# EAGLE design (Eagle)USB_JST-XH_Converter (EAGLE 9.6.2)

## Sheet 1 of 3
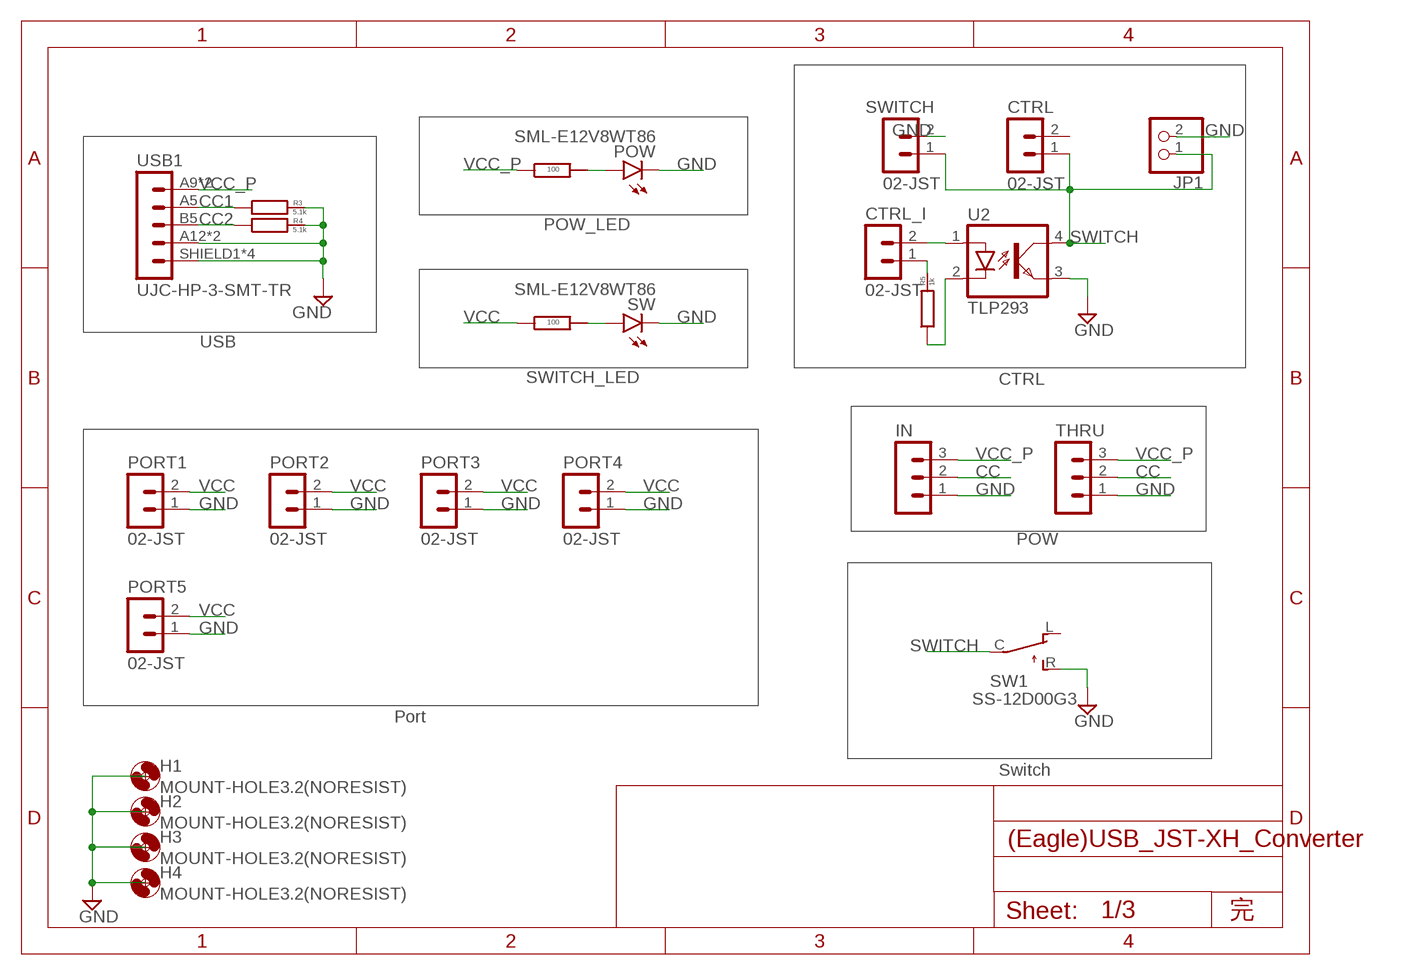
[diagram p0: schematic, sheet 1]

### Parts
CTRL  02-JST  [B2B-XH]
CTRL_I  02-JST  [B2B-XH]
H1  MOUNT-HOLE3.2(NORESIST)  [3,2]
H2  MOUNT-HOLE3.2(NORESIST)  [3,2]
H3  MOUNT-HOLE3.2(NORESIST)  [3,2]
H4  MOUNT-HOLE3.2(NORESIST)  [3,2]
IN  03-JST  [B3B-XH]
JP1  PINHD-1X2  [1X02]
PORT1  02-JST  [B2B-XH]
PORT2  02-JST  [B2B-XH]
PORT3  02-JST  [B2B-XH]
PORT4  02-JST  [B2B-XH]
PORT5  02-JST  [B2B-XH]
POW  SML-E12V8WT86  [SML-E12V8WT86]
R1  RG2012N-101-B-T5  [RG2012]
R2  RG2012N-101-B-T5  [RG2012]
R3  5.1k  RG2012  [RG2012]
R4  5.1k  RG2012  [RG2012]
R5  1k  RG2012  [RG2012]
SW  SML-E12V8WT86  [SML-E12V8WT86]
SW1  SS-12D00G3  [SS-12D00G3]
SWITCH  02-JST  [B2B-XH]
THRU  03-JST  [B3B-XH]
U2  TLP293  [SO4_TOS]
USB1  UJC-HP-3-SMT-TR  [UJC-HP-3-SMT-TR]

### Nets
CC: IN.2 THRU.2 ; also sheet 3
CC1: R3.LEFT USB1.A5(CC1) ; also sheet 3
CC2: R4.LEFT USB1.B5(CC2) ; also sheet 3
GND: H1.P$1 H2.P$1 H3.P$1 H4.P$1 IN.1 JP1.2 PORT1.1 PORT2.1 PORT3.1 PORT4.1 PORT5.1 POW.K(C) R3.RIGHT R4.RIGHT SW1.R SW.K(C) SWITCH.2 THRU.1 U2.3 USB1.A12(GND) USB1.B12(GND) USB1.SHIELD1(SHIELD) USB1.SHIELD2(SHIELD) USB1.SHIELD3(SHIELD) USB1.SHIELD4(SHIELD) ; also sheet 2,3
N$1: POW.A R1.LEFT
N$3: R2.LEFT SW.A
N$8: CTRL_I.2 U2.1
N$9: CTRL_I.1 R5.RIGHT
N$10: R5.LEFT U2.2
SWITCH: CTRL.1 JP1.1 SW1.C SWITCH.1 U2.4 ; also sheet 2
VCC: PORT1.2 PORT2.2 PORT3.2 PORT4.2 PORT5.2 R2.RIGHT ; also sheet 2
VCC_P: IN.3 R1.RIGHT THRU.3 USB1.A9(V-BUS) USB1.B9(V-BUS) ; also sheet 2,3
Unconnected: CTRL.2 SW1.L

### Notes on the sheet
- POW_LED
- USB
- SWITCH_LED | CTRL
- POW
- Port
- Switch
- 完

## Sheet 2 of 3
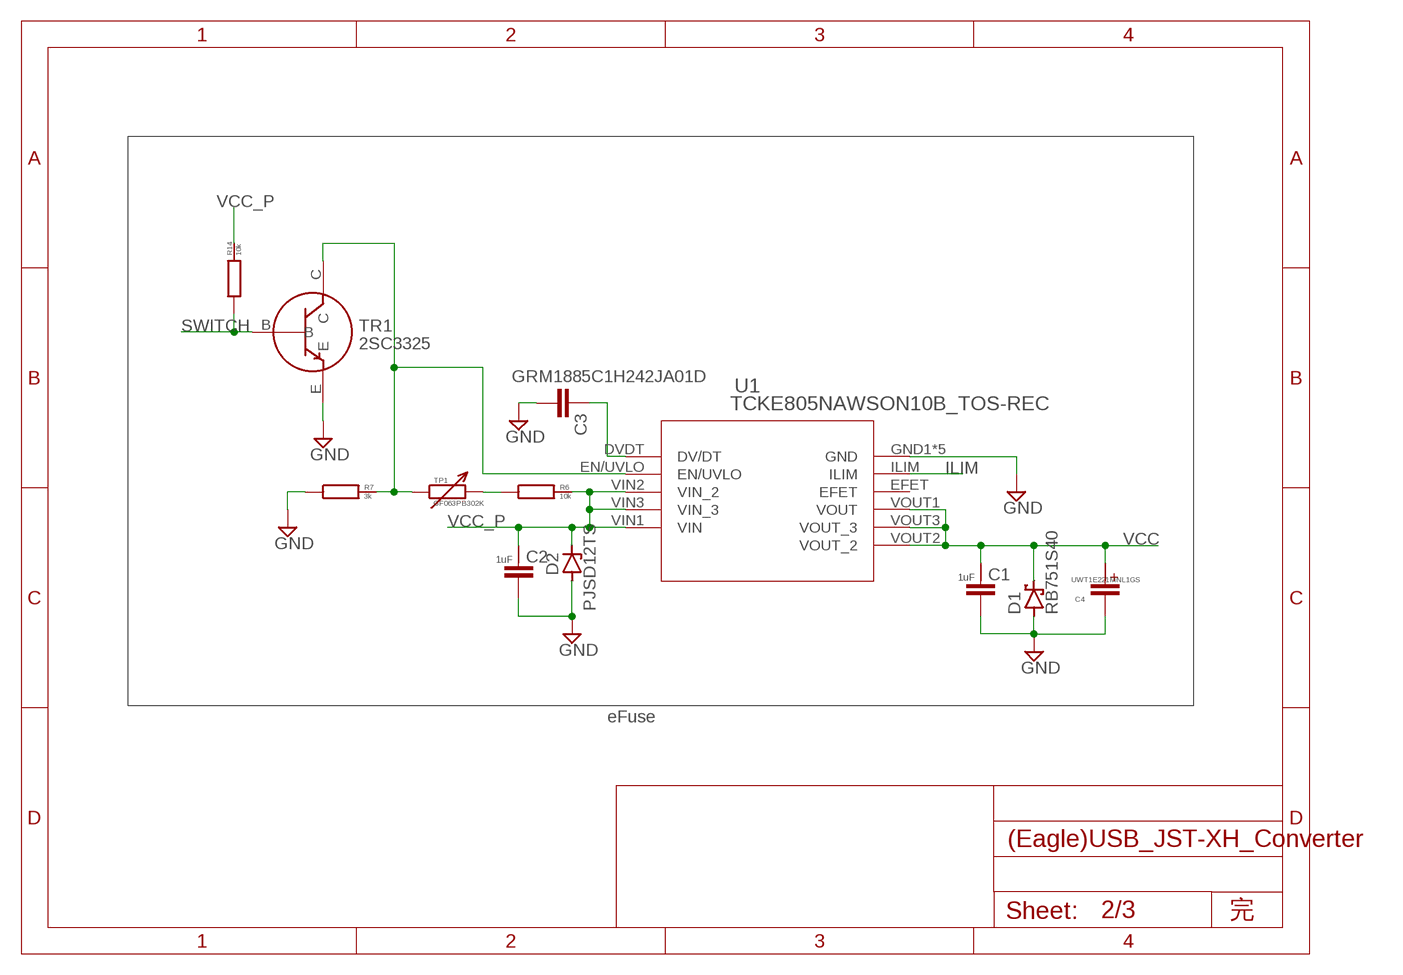
[diagram p1: schematic, sheet 2]

### Parts
C1  GRM21BC72A105KE01  [GRM21BC72A105KE01]
C2  GRM21BC72A105KE01  [GRM21BC72A105KE01]
C3  GRM1885C1H242JA01D  [GRM18]
C4  UWT1E221MNL1GS  [UWT1E221MNL1GS]
D1  RB751S40  [SOD-523]
D2  PJSD12TS  [SOD-523]
R6  10k  RG2012  [RG2012]
R7  3k  RG2012  [RG2012]
R14  10k  RG2012  [RG2012]
TP1  GF063PB302K  [GF063PB104K]
TR1  2SC3325  [2SC3325]
U1  TCKE805NAWSON10B_TOS-REC  [WSON10B_TOS-RIC]

### Nets
GND: C1.P$2 C2.P$2 C3.R C4.C(CATHODE) D1.A D2.A R7.LEFT TR1.E U1.GND1(GND) U1.GND2(GND) U1.GND3(GND) U1.GND4(GND) U1.GND5(GND) ; also sheet 1,3
ILIM: U1.ILIM ; also sheet 3
N$2: R7.RIGHT TP1.LEFT TR1.C U1.EN/UVLO
N$6: R6.LEFT TP1.CENTER(RIGHT) TP1.RIGHT
N$7: C3.L U1.DVDT(DV/DT)
SWITCH: R14.LEFT TR1.B ; also sheet 1
VCC: C1.P$1 C4.A(ANODE) D1.C U1.VOUT1(VOUT) U1.VOUT2(VOUT_2) U1.VOUT3(VOUT_3) ; also sheet 1
VCC_P: C2.P$1 D2.C R6.RIGHT R14.RIGHT U1.VIN1(VIN) U1.VIN2(VIN_2) U1.VIN3(VIN_3) ; also sheet 1,3
Unconnected: U1.EFET

### Notes on the sheet
- eFuse
- 完

## Sheet 3 of 3
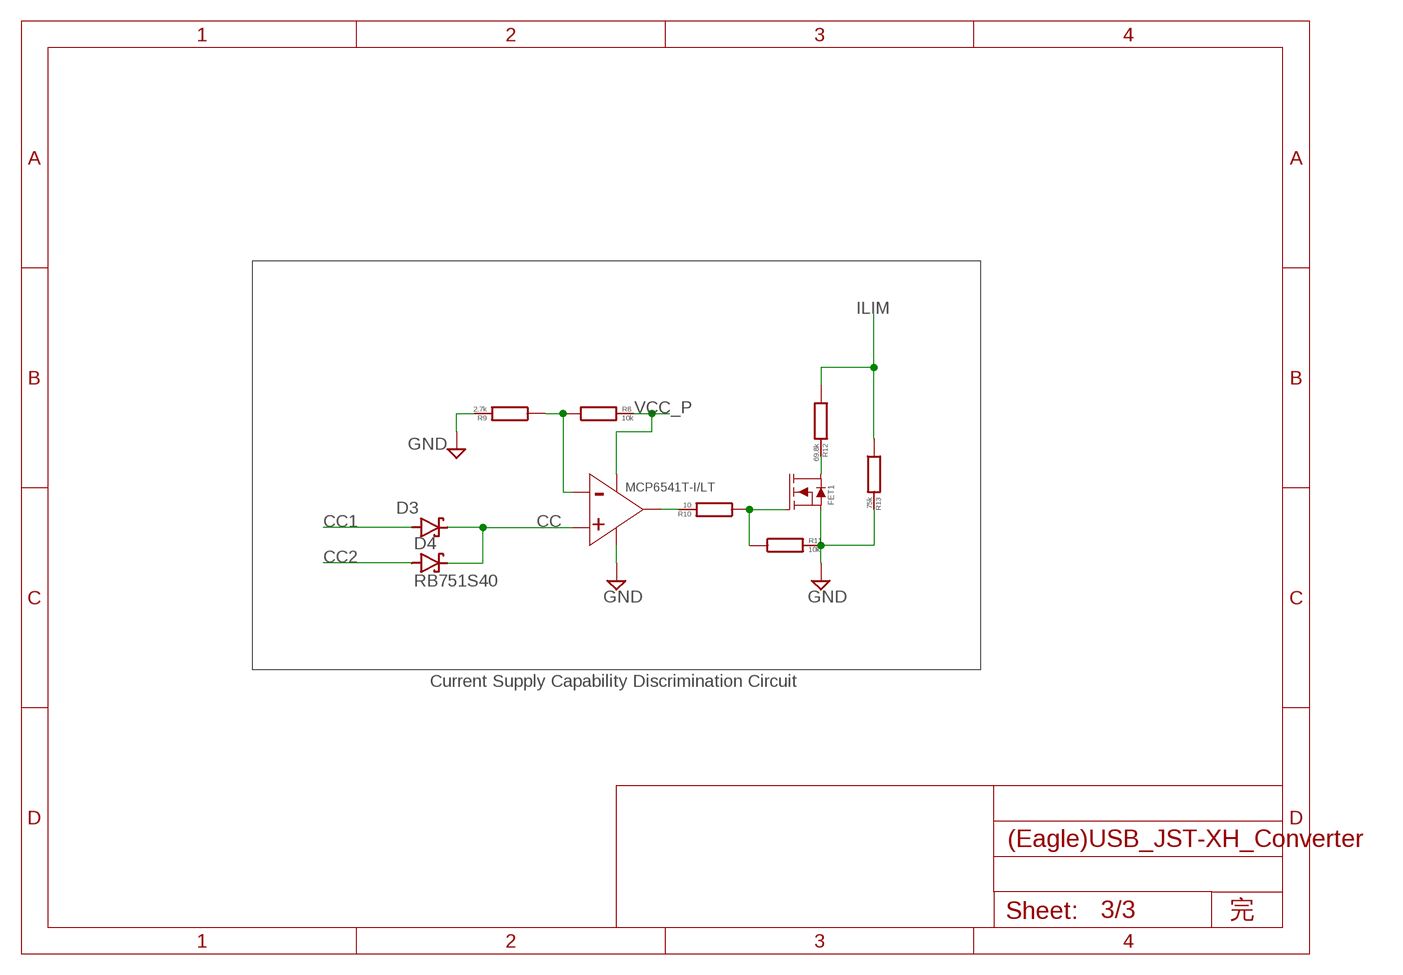
[diagram p2: schematic, sheet 3]

### Parts
COMP1  MCP6541T-I/LT  [SC-70-5]
D3  RB751S40  [SOD-523]
D4  RB751S40  [SOD-523]
FET1  BSS138  [SOT-23]
R8  10k  RG2012  [RG2012]
R9  2.7k  RG2012  [RG2012]
R10  10  RG2012  [RG2012]
R11  10k  RG2012  [RG2012]
R12  69.8k  RG2012  [RG2012]
R13  75k  RG2012  [RG2012]

### Nets
CC: COMP1.IN+ D3.C D4.C ; also sheet 1
CC1: D3.A ; also sheet 1
CC2: D4.A ; also sheet 1
GND: COMP1.VSS FET1.S R9.RIGHT R11.RIGHT R13.RIGHT ; also sheet 1,2
ILIM: R12.LEFT R13.LEFT ; also sheet 2
N$4: COMP1.IN- R8.LEFT R9.LEFT
N$5: FET1.G R10.LEFT R11.LEFT
N$12: COMP1.OUT R10.RIGHT
N$15: FET1.D R12.RIGHT
VCC_P: COMP1.VDD R8.RIGHT ; also sheet 1,2

### Notes on the sheet
- Current Supply Capability Discrimination Circuit
- 完

## Library data of the parts
C1 C2 = GRM21BC72A105KE01(1uF):GRM21BC72A105KE01
C3 = GRM1885C1H242JA01D:GRM1885C1H242JA01D
C4 = UWT1E221MNL1GS:UWT1E221MNL1GS
COMP1 = MCP6541T-I:MCP6541T-I/LT
CTRL CTRL_I PORT1-PORT5 SWITCH = con-jst-xh:02-JST: JST CONNECTOR
D1 D3 D4 = RB751S40:RB751S40
D2 = PJSD12TS:PJSD12TS
FET1 = BSS138:BSS138
H1-H4 = MOUNT-HOLE3.2(NORESIST):MOUNT-HOLE3.2(NORESIST)
IN THRU = con-jst-xh:03-JST: JST CONNECTOR
JP1 = pinhead:PINHD-1X2: PIN HEADER
POW SW = SML-E12V8WT86:SML-E12V8WT86
R1 R2 = RG2012N-101-B-T5:RG2012N-101-B-T5
R3-R14 = RG2012:RG2012
SW1 = SS-12D00G3:SS-12D00G3
TP1 = GF063P B104K:GF063PB302K
TR1 = 2SC3325:2SC3325
U1 = TCKE805NA:TCKE805NA
U2 = TLP293:TLP293; COPYRIGHT: Copyright (C) 2022 Ultra Librarian. All rights reserved.; MANUFACTURER_PART_NUMBER: TLP293; MFR_NAME: Toshiba Electronic Devices & Storage Corp.
USB1 = UJC-HP-3-SMT-TRv2:UJC-HP-3-SMT-TR

## Board
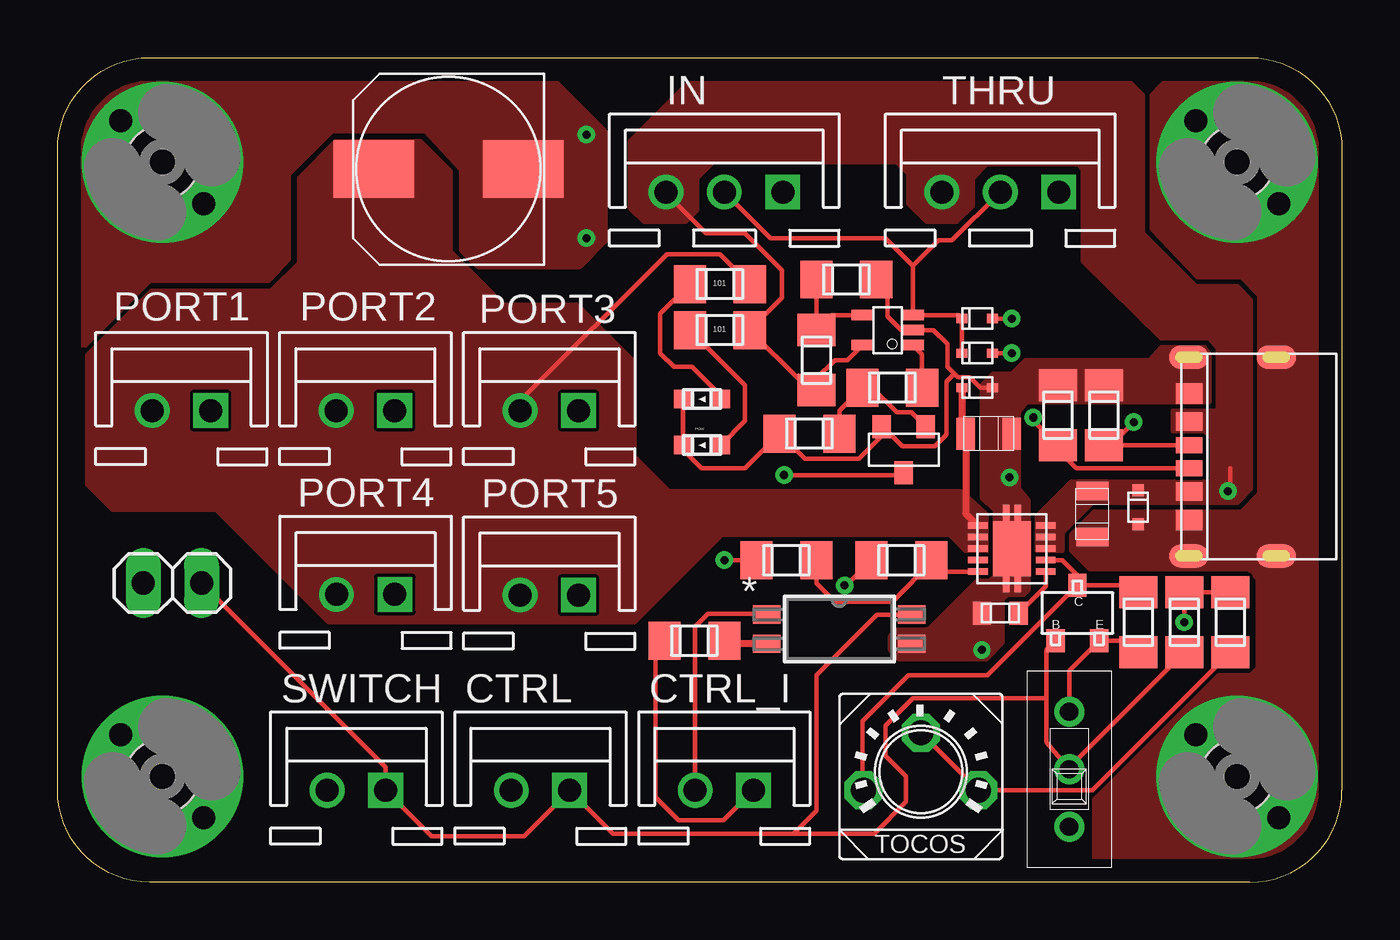
[diagram p3: board, top side]
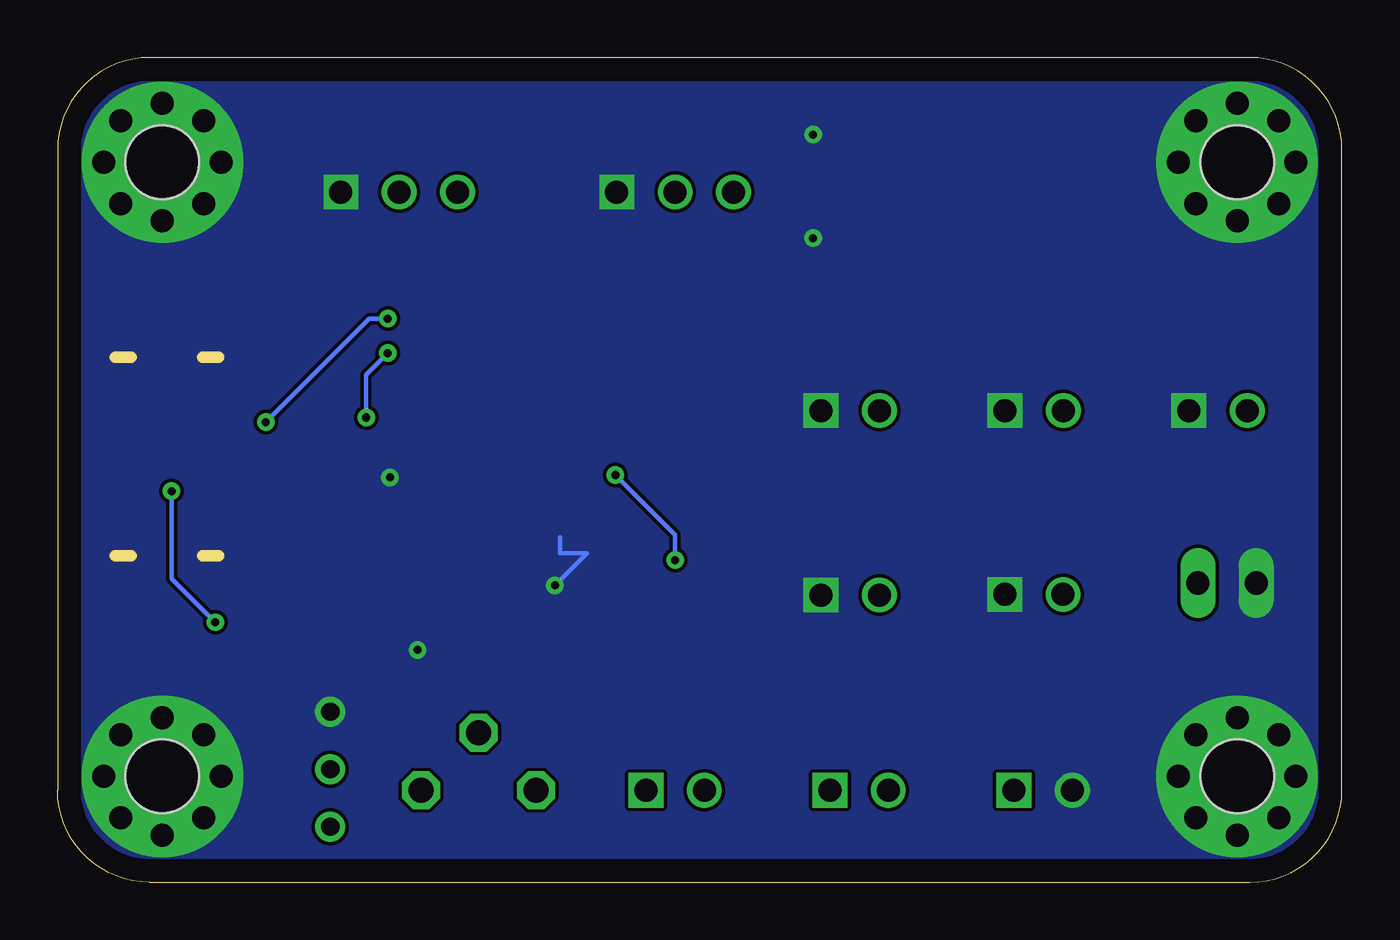
[diagram p4: board, bottom side, seen from below]

Size 55.86 x 35.85 mm. Coordinates in mm from the lower left corner, seen from the top.
Outline: 4,35.85 51.86,35.85 arc-90 55.86,31.85 55.86,4 arc-90 51.86,0 4,0 arc-90 0,4 0,31.85 arc-90 4,35.85
Copper layers (1*16): Top 0.035mm / dielectric 1.5mm / Bottom 0.035mm
Design rules "default": minimum track width 6mil, minimum drill 0.35mm, track to track 6mil, track to pad 6mil, pad to pad 6mil, via to via 6mil, smd to smd 6mil, copper to edge 40mil, drill to drill 6mil, minimum pad ring 10mil, minimum via ring 8mil, stop-mask expansion 4mil, vias tented up to drill 0mil, thermal gap 10mil

### Footprints (pad centres in the part's own frame; a part is rotated, then mirrored left to right if it is on the bottom)
GRM21BC72A105KE01 = smd 0.8 x 1.4: P$1 -1,0; P$2 1,0
GRM18 = smd 0.8 x 1: L -0.8,0; R 0.8,0
UWT1E221MNL1GS = smd 3.5 x 2.5: A -3.25,0; C 3.25,0
SC-70-5 = smd 0.45 x 0.95: IN+ -0.65,2.2; IN- -0.65,0; OUT 0.65,2.2; VDD 0.65,0; VSS 0,2.2
B2B-XH = drill 1 square: 1 1.27,0 | drill 1: 2 -1.27,0
SOD-523 = smd 0.48 x 0.4: A 0.66,0; C -0.66,0
SOD-523' = smd 0.53 x 0.5: A 0.735,0; C -0.735,0
SOT-23 = smd 0.8 x 1: D 0,2; G -0.95,0; S 0.95,0
3,2 = drill 3.197 pad 7.01: P$1 0,0 | hole 3.2: 0,0
B3B-XH = drill 1 square: 1 2.54,0 | drill 1: 2 0,0; 3 -2.54,0
1X02 = drill 1.016 long: 1 -1.27,0; 2 1.27,0
SML-E12V8WT86 = smd 0.8 x 0.8: A 0,1.65; K 0,0
RG2012 = smd 1.4 x 1.65: LEFT 0,0; RIGHT 2.6,0
SS-12D00G3 = drill 0.8: C 0,0; L -2.5,0; R 2.5,0
GF063PB104K = drill 1.1 octagon: CENTER 3.55,5.5; LEFT 1.05,3; RIGHT 6.05,3
2SC3325 = smd 1 x 0.8: B 0,1.9; C 2.4,0.95; E 0,0
WSON10B_TOS-RIC = smd 0.85 x 0.28: DVDT -1.475,1; EFET 1.475,0.5; EN/UVLO -1.475,0.5; ILIM 1.475,1; VIN1 -1.475,0; VIN2 -1.475,-0.5; VIN3 -1.475,-1; VOUT1 1.475,0; VOUT2 1.475,-0.5; VOUT3 1.475,-1 | smd 1.65 x 2.4: GND1 0,0 | smd 0.28 x 0.7: GND2 -0.25,1.55; GND3 0.25,1.55; GND4 -0.25,-1.55; GND5 0.25,-1.55
SO4_TOS = smd 1.2 x 0.8: 1 -3.15,0.635; 2 -3.15,-0.635; 3 3.15,-0.635; 4 3.15,0.635
UJC-HP-3-SMT-TR = smd 0.7 x 1.15: A5 -0.5,3.8; B5 0.5,3.8 | smd 0.8 x 1.15: A9 1.52,3.8; B9 -1.52,3.8 | smd 0.9 x 1.15: A12 2.75,3.8; B12 -2.75,3.8 | smd 1 x 1.7: SHIELD1 -4.32,3.8; SHIELD2 4.32,3.8; SHIELD3 -4.32,0; SHIELD4 4.32,0

### Placement (x,y rotation side)
C1  40.5,19.5 0 top
C2  45,16 270 top
C3  41,11.7 180 top
C4  17,31 0 top
COMP1  35,24 270 top
CTRL  21,4 0 top
CTRL_I  29,4 0 top
D1  40,21.5 0 top
D2  PJSD12TS  [SOD-523']  47,16.3 270 top
D3  40,23 0 top
D4  40,24.5 0 top
FET1  36.8,19.8 180 top
H1  4.56,31.3 0 top
H2  4.56,4.6 0 top
H3  51.3,31.3 0 top
H4  51.3,4.6 0 top
IN  29,30 0 top
JP1  5,13 180 top
PORT1  5.39,20.5 0 top
PORT2  13.39,20.5 0 top
PORT3  21.39,20.5 0 top
PORT4  13.4,12.51 0 top
PORT5  21.39,12.48 0 top
POW  27.2,19 270 top
R1  27.5,24 0 top
R2  27.5,26 0 top
R3  43.5,19 90 top
R4  45.5,19 90 top
R5  29,10.5 180 top
R6  51,10 90 top
R7  47,10 90 top
R8  33,24 270 top
R9  33,26.2 0 top
R10  35,21.5 0 top
R11  34,19.5 180 top
R12  33,14 180 top
R13  38,14 180 top
R14  49,10 90 top
SW  27.2,21 270 top
SW1  44,4.91 90 top
SWITCH  13,4 0 top
THRU  41,30 0 top
TP1  34,1 0 top
TR1  45.3,10.5 90 top
U1  41.5,14.5 180 top
U2  34,11 0 top
USB1  53,18.5 90 top

### Tracks (layer width: path | path; a pad name or v marks a point on that pad's centre or on a via)
CC
  Top 0.2: D3.C D4.C 39.19,24.65 COMP1.IN+ 37.2,26.8 | IN.2 31,28 36,28 37.2,26.8 | 37.2,26.8 38.3,27.9 38.9,27.9 THRU.2
CC1  (via drill 0.35)
  Top 0.2: USB1.A5 44.3,18 43.5,18.8 R3.LEFT 42.43,20.07 v42.43,20.2 | 40.66,22.94 D3.A v41.5,23
  Bottom 0.2: v42.43,20.2 42.43,22.07 v41.5,23
CC2  (via drill 0.35)
  Top 0.2: USB1.B5 R4.LEFT 45.8,19 v46.8,20 | v41.5,24.5 D4.A
  Bottom 0.2: v46.8,20 42.3,24.5 v41.5,24.5
GND  (via drill 0.35, 1)
  Top 0.2: SW1.R 44,9.2 TR1.E 46.5,10.5 R7.LEFT | R9.RIGHT 36.1,25.7 36.1,24.6 36.7,24 COMP1.VSS 38.1,24 38.7,23.4 38.7,22.4 39,22.1 | SW.K POW.K 27.2,18.8 28,18 29.9,18 R11.RIGHT 32.5,18.4 34.85,18.4 35.85,19.4 FET1.S 35.89,19.8 36.74,18.95 38.16,18.95 38.65,19.45 38.65,21.75 39,22.1 | D1.A 40.14,21.5 39.69,21.95 39.15,21.95 39,22.1 | R13.RIGHT 34.3,12.9 v34.23,12.9
  Bottom 0.2: v34.23,12.9 32.83,14.3 34,14.3 34,15
  other vias: 48.75,31.3 49.5,29.5 51.3,28.75 53.1,29.5 53.85,31.3 53.1,33.1 51.3,33.85 49.5,33.1 2.01,31.3 2.76,29.5 4.56,28.75 6.36,29.5 7.11,31.3 6.36,33.1 4.56,33.85 2.76,33.1 2.01,4.6 2.76,2.8 4.56,2.05 6.36,2.8 7.11,4.6 6.36,6.4 4.56,7.15 2.76,6.4 48.75,4.6 49.5,2.8 51.3,2.05 53.1,2.8 53.85,4.6 53.1,6.4 51.3,7.15 49.5,6.4 41.4,17.6 40.2,10.1 23,32.5 23,28
  pour Bottom (no thermals): -7,41 -7,-4 66,-4 66,43 -5,43
  pour Top (no thermals): 50.1,20.86 42.15,20.86 41.8,20.43 41.8,17.11 42.23,16.6 42.23,12.7 42,12.5 41.3,12.5 41.1,12.3 41.1,10.4 40.4,9.7 36.6,9.7 36.2,10.1 36.2,10.7 36.5,11 37.9,11 40,13.1 40.54,13.1 40.76,13.3 40.76,16.2 40.2,16.7 40.2,21.6 40.7,22.1 41.5,22.1 42.1,22.7 47.5,22.7 48,23.25 49.9,23.25 50.1,23
  pour Top (no thermals): 44.1,14.4 44.1,15.1 45.1,16.1 51.5,16.1 52.26,16.9 52.26,25.5 51.5,26.3 49.6,26.3 47.6,28.4 47.6,34.2 50.04,36.8 56.9,36.8 56.9,2 53.8,-1.1 53.7,-1 45.1,-1 45.1,3.6 50.5,9 51.9,9 52.2,9.3 52.2,13.2 51.8,13.6 44.9,13.6
  pour Top (no thermals): 4,26.2 9.18,26.2 10,27.1 10,30.8 11.94,32.7 16,32.7 17.6,31 17.6,27.5 18.3,26.8 22.7,26.8 23.8,27.9 23.8,32.6 19.1,37.3 3.6,37.3 -1.2,32.5 -1.2,22.3 0.1,22.3
ILIM
  Top 0.2: U1.ILIM 38.5,13.5 38.05,13.95 | 38.05,13.95 R13.LEFT | R12.LEFT 33,13 33.8,12.2 36.3,12.2 38.05,13.95
N$1
  Top 0.2: R1.LEFT 29.9,21.6 29.9,20.05 POW.A
N$2
  Top 0.2: TR1.C 44.35,13.35 43.7,14 U1.EN/UVLO | TR1.C 46.7,12.9 R7.RIGHT | TP1.LEFT 35,4.05 35,7 37,9 40.44,9 TR1.C
N$3
  Top 0.2: R2.LEFT 26.2,24.7 26.2,23 26.8,22.4 27.6,22.4 28.85,21.15 SW.A
N$4
  Top 0.2: R9.LEFT R8.LEFT 33.65,24.65 COMP1.IN-
N$5
  Top 0.2: R11.LEFT 34,20.5 R10.LEFT 35.42,21.5 36.49,20.42 37.13,20.42 FET1.G
N$6
  Top 0.2: TP1.CENTER TP1.RIGHT 45,4 R6.LEFT
N$7
  Top 0.2: U1.DVDT 42.98,12.88 C3.L
N$8
  Top 0.2: CTRL_I.2 27.73,11.11 28.3,11.68 30.81,11.68 U2.1
N$9
  Top 0.2: CTRL_I.1 28.97,2.7 27,2.7 26,3.7 26,10.1 R5.RIGHT
N$10
  Top 0.3: U2.2 29.14,10.36 R5.LEFT
N$12
  Top 0.2: COMP1.OUT 37.6,22.95 R10.RIGHT
N$15  (via drill 0.35)
  Top 0.2: R12.RIGHT v29,14 | FET1.D 36.7,17.7 v31.6,17.7
  Bottom 0.2: v29,14 29,15.1 v31.6,17.7
SWITCH
  Top 0.2: R14.LEFT 44.09,5.09 SW1.C 43,6.09 43,8 | TR1.B 43,10.1 43,8 | JP1.1 14.27,5 SWITCH.1 16.27,2 20.3,2 22.27,3.97 CTRL.1 24.15,2.12 32,2.12 | 32,2.12 33,3.12 33,9 35.63,11.64 U2.4 | 32,2.12 35.52,2.12 36.9,3.5 36.9,4.6 36,5.5 36,6.8 37.2,8 43,8
VCC
  Top 0.2: R2.RIGHT 28.8,27.3 26.5,27.3 20.12,20.92 PORT3.2
  Top 0.3: D1.C 39.34,19.66 C1.P$1 39.5,16.02 U1.VOUT3
  pour Top (no thermals): 40.4,14.3 39.6,14.3 38.8,15.1 28.9,15.1 25.1,11.3 11.8,11.3 6.9,16.2 2.4,16.2 1.3,17.3 1.3,22.9 4.1,25.7 9.3,25.7 10.5,26.9 10.5,30.6 12.1,32.2 15.8,32.2 17.1,30.9 17.1,27.4 19.4,25.1 22.6,25.1 25.1,22.6 25.1,18.5 26.6,17 39.3,17 40.4,16
VCC_P  (via drill 0.35)
  Top 0.2: 34.65,23.35 COMP1.VDD 34.35,22.7 33.8,22.7 33,21.9 R8.RIGHT | 33.1,21.8 R8.RIGHT | R8.RIGHT 32.3,21.8 R1.RIGHT 31.5,25.4 31.5,26.6 29.9,28.2 28.2,28.2 26.46,29.94 IN.3 | R6.RIGHT R14.RIGHT v49,11.3 | v50.9,17 51,17.1 51,18
  Bottom 0.2: v49,11.3 50.9,13.2 v50.9,17
  pour Top (no thermals): 50.2,17.4 44.1,17.4 42.6,15.9 42.6,14.4 43.7,14.4 43.7,15.2 45,16.5 51.3,16.5 51.9,17.1 51.9,25.3 51.3,25.9 49.5,25.9 47.2,28.2 47.2,34.2 44.4,37 29.7,37 24.9,32.2 24.9,29.3 25.5,28.7 27.3,28.7 27.8,29.2 27.8,30.6 28.5,31.3 36.5,31.3 37,30.8 37,29.5 37.8,28.7 39.1,28.7 39.8,29.4 39.8,30.6 40.4,31.2 44.4,31.2 44.6,31 44.6,27 48,23.65 50.1,23.65 50.46,23.21 50.46,20.5 48.5,20.5 48.5,19.6 49.9,19.6 50.2,19.3